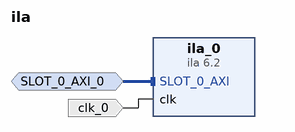
[diagram p0: block diagram of the top level]
# Vivado block design ila, xc7z020clg484-1, Vivado 2021.1.1
create_bd_design ila

create_bd_intf_port -mode Monitor -vlnv xilinx.com:interface:aximm_rtl:1.0 SLOT_0_AXI_0
set_property -dict [list \
  CONFIG.ADDR_WIDTH 32 \
  CONFIG.ARUSER_WIDTH 1 \
  CONFIG.AWUSER_WIDTH 1 \
  CONFIG.BUSER_WIDTH 1 \
  CONFIG.DATA_WIDTH 32 \
  CONFIG.ID_WIDTH 1 \
  CONFIG.NUM_READ_OUTSTANDING 2 \
  CONFIG.NUM_WRITE_OUTSTANDING 2 \
  CONFIG.PROTOCOL AXI4 \
  CONFIG.RUSER_WIDTH 1 \
  CONFIG.WUSER_WIDTH 1 \
] [get_bd_intf_ports SLOT_0_AXI_0]
create_bd_port -dir I -type clk clk_0

create_bd_cell -type ip -vlnv xilinx.com:ip:ila:6.2 ila_0

# ---- connections ----

connect_bd_intf_net [get_bd_intf_ports SLOT_0_AXI_0] [get_bd_intf_pins ila_0/SLOT_0_AXI]
connect_bd_net -net clk_0_1 [get_bd_ports clk_0] [get_bd_pins ila_0/clk]

validate_bd_design
save_bd_design
